# Altium schematic sheet Tracker RS232_2.SchDoc: GPS Tracker APRS based
size A4; DrawnBy: I. Ivanov; Engineer: Eng. I. Ivanov; SheetNumber: 3; SheetTotal: 3; ProjectName: GPS Tracker APRS based
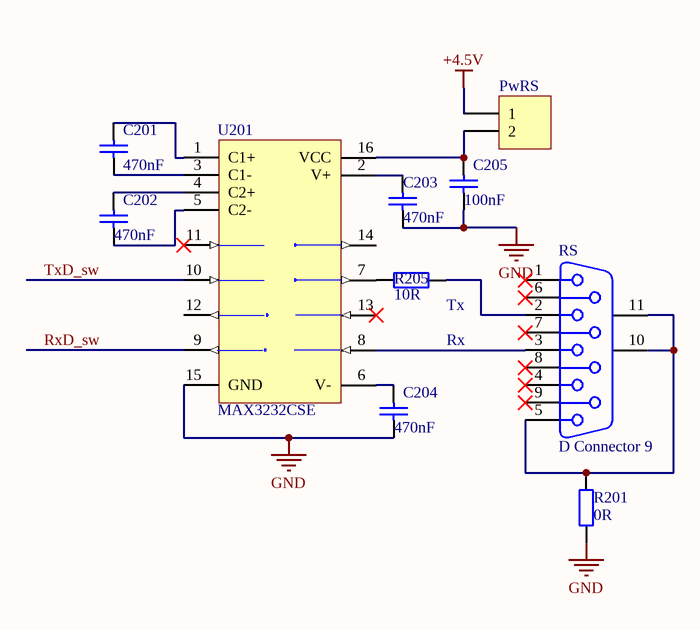
[diagram p0: Tracker RS232_2.SchDoc]

## Parts
C201  value 470nF  [2012[0805]]  (hidden comment: Cap Semi)
C202  value 470nF  [2012[0805]]  (hidden comment: Cap Semi)
C203  value 470nF  [2012[0805]]  (hidden comment: Cap Semi)
C204  value 470nF  [2012[0805]]  (hidden comment: Cap Semi)
C205  value 100nF  [2012[0805]]  (hidden comment: Cap Semi)
PwRS  Header 2  [HDR1X2]  (value not drawn)
R201  value 0R  [3216[1206]]  (hidden comment: Res2)
R205  value 10R  [2012[0805]]  (hidden comment: Res2)
RS  D Connector 9  [DSUB1.385-2H9]
U201  MAX3232CSE  [NSO16_N]

## Nets
+4.5V: PwRS.1
GND: C203.1 C204.1 C205.1 R201.2 U201.15(GND)
RxD_sw: U201.9(R2OUT)
TxD_sw: U201.10(T2IN)
NetC201_1: C201.1 U201.3(C1-)
NetC201_2: C201.2 U201.1(C1+)
NetC202_1: C202.1 U201.5(C2-)
NetC202_2: C202.2 U201.4(C2+)
NetC203_2: C203.2 U201.2(V+)
NetC204_2: C204.2 U201.6(V-)
NetC205_2: C205.2 PwRS.2 U201.16(VCC)
NetR201_1: R201.1 RS.5 RS.10(MH1) RS.11(MH2)
NetR205_1: R205.1 U201.7(T2OUT)
NetR205_2: R205.2 RS.2
NetRS_3: RS.3 U201.8(R2IN)

Not connected (* = marked no-connect by the designer): RS 1* 4* 6* 7* 8* 9*; U201 11(T1IN)* 12(R1OUT) 13(R1IN)* 14(T1OUT)

## Notes on the sheet
- (near R205) Tx
- Rx

## Library data of the parts
C201-C205 = Cap Semi: Capacitor (Semiconductor SIM Model); Published: 8-Jun-2000; LatestRevisionDate: 17-Jul-2002; LatestRevisionNote: Re-released for DXP Platform.; PackageReference: C1206; Publisher: Altium Limited
PwRS = Header 2: Header, 2-Pin; LatestRevisionDate: 17-Jul-2002; LatestRevisionNote: Re-released for DXP Platform.; Publisher: Altium Limited
R201 R205 = Res2: Resistor; Published: 8-Jun-2000; LatestRevisionDate: 17-Jul-2002; LatestRevisionNote: Re-released for DXP Platform.; PackageReference: AXIAL-0.4; Publisher: Altium Limited
RS = D Connector 9: Receptacle Assembly, 9 Position, Right Angle; PackageDocument: O; Positions: 9; Published: 15-Jun-2001; LatestRevisionDate: 17-Jul-2002; LatestRevisionNote: Re-released for DXP Platform.; DatasheetDocument: 1-Sep-1999; PackageReference: 788750; Publisher: Altium Limited; Orientation: Right Angle; Gender: Receptacle
U201 = MAX3232CSE: 3.0V TO 5.5V, Low-Power, up to 1Mbps, True RS-232 Transceiver Using Four 0.1µF External Capacitor; Published: 16-Jan-2001; LatestRevisionDate: 13-Apr-2006; LatestRevisionNote: IPC-7351 Footprint Added.; DatasheetVersion: Mar-1999; PackageReference: NSO16; Publisher: Altium Limited; PackageDescription: 16-Pin Small Outline Integrated Circuit 1.27 mm Pitch; Code_JEDEC: MS-012-AC; Code_IPC: SOIC127P600-16; ComponentLink1Description: Manufacturer Link; ComponentLink1URL: http://www.maxim-ic.com/; ComponentLink2Description: Datasheet; ComponentLink2URL: http://pdfserv.maxim-ic.com/en/ds/MAX3222-MAX3241.pdf